# Altium schematic sheet DAC.SchDoc
size A4
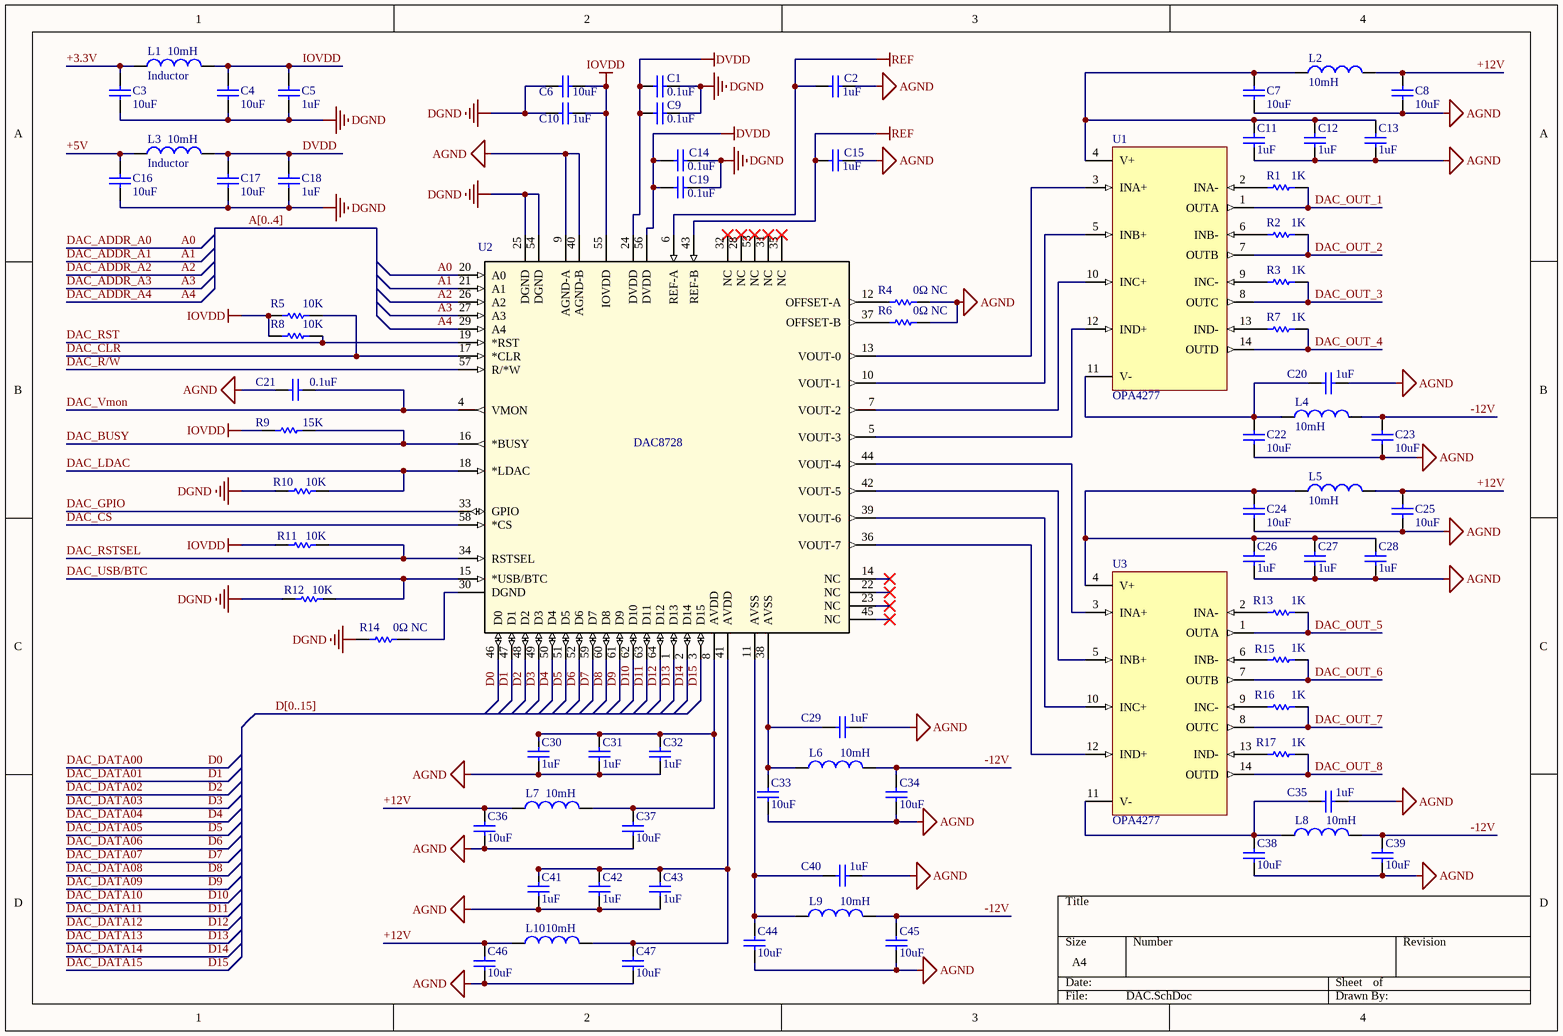
[diagram p0: DAC.SchDoc]

## Parts
C1  value 0.1uF  [1608[0603]]  (hidden comment: Cap)
C2  value 1uF  [1608[0603]]  (hidden comment: Cap)
C3  value 10uF  [1608[0603]]  (hidden comment: Cap)
C4  value 10uF  [1608[0603]]  (hidden comment: Cap)
C5  value 1uF  [1608[0603]]  (hidden comment: Cap)
C6  value 10uF  [1608[0603]]  (hidden comment: Cap)
C7  value 10uF  [1608[0603]]  (hidden comment: Cap)
C8  value 10uF  [1608[0603]]  (hidden comment: Cap)
C9  value 0.1uF  [1608[0603]]  (hidden comment: Cap)
C10  value 1uF  [1608[0603]]  (hidden comment: Cap)
C11  value 1uF  [1608[0603]]  (hidden comment: Cap)
C12  value 1uF  [1608[0603]]  (hidden comment: Cap)
C13  value 1uF  [1608[0603]]  (hidden comment: Cap)
C14  value 0.1uF  [1608[0603]]  (hidden comment: Cap)
C15  value 1uF  [1608[0603]]  (hidden comment: Cap)
C16  value 10uF  [1608[0603]]  (hidden comment: Cap)
C17  value 10uF  [1608[0603]]  (hidden comment: Cap)
C18  value 1uF  [1608[0603]]  (hidden comment: Cap)
C19  value 0.1uF  [1608[0603]]  (hidden comment: Cap)
C20  value 1uF  [1608[0603]]  (hidden comment: Cap)
C21  value 0.1uF  [1608[0603]]  (hidden comment: Cap)
C22  value 10uF  [1608[0603]]  (hidden comment: Cap)
C23  value 10uF  [1608[0603]]  (hidden comment: Cap)
C24  value 10uF  [1608[0603]]  (hidden comment: Cap)
C25  value 10uF  [1608[0603]]  (hidden comment: Cap)
C26  value 1uF  [1608[0603]]  (hidden comment: Cap)
C27  value 1uF  [1608[0603]]  (hidden comment: Cap)
C28  value 1uF  [1608[0603]]  (hidden comment: Cap)
C29  value 1uF  [1608[0603]]  (hidden comment: Cap)
C30  value 1uF  [1608[0603]]  (hidden comment: Cap)
C31  value 1uF  [1608[0603]]  (hidden comment: Cap)
C32  value 1uF  [1608[0603]]  (hidden comment: Cap)
C33  value 10uF  [1608[0603]]  (hidden comment: Cap)
C34  value 10uF  [1608[0603]]  (hidden comment: Cap)
C35  value 1uF  [1608[0603]]  (hidden comment: Cap)
C36  value 10uF  [1608[0603]]  (hidden comment: Cap)
C37  value 10uF  [1608[0603]]  (hidden comment: Cap)
C38  value 10uF  [1608[0603]]  (hidden comment: Cap)
C39  value 10uF  [1608[0603]]  (hidden comment: Cap)
C40  value 1uF  [1608[0603]]  (hidden comment: Cap)
C41  value 1uF  [1608[0603]]  (hidden comment: Cap)
C42  value 1uF  [1608[0603]]  (hidden comment: Cap)
C43  value 1uF  [1608[0603]]  (hidden comment: Cap)
C44  value 10uF  [1608[0603]]  (hidden comment: Cap)
C45  value 10uF  [1608[0603]]  (hidden comment: Cap)
C46  value 10uF  [1608[0603]]  (hidden comment: Cap)
C47  value 10uF  [1608[0603]]  (hidden comment: Cap)
L1  Inductor  value 10mH  [2029]
L2  value 10mH  [2029]  (hidden comment: Inductor)
L3  Inductor  value 10mH  [2029]
L4  value 10mH  [2029]  (hidden comment: Inductor)
L5  value 10mH  [2029]  (hidden comment: Inductor)
L6  value 10mH  [2029]  (hidden comment: Inductor)
L7  value 10mH  [2029]  (hidden comment: Inductor)
L8  value 10mH  [2029]  (hidden comment: Inductor)
L9  value 10mH  [2029]  (hidden comment: Inductor)
L10  value 10mH  [2029]  (hidden comment: Inductor)
R1  value 1K  [1608[0603]]  (hidden comment: Res1)
R2  value 1K  [1608[0603]]  (hidden comment: Res1)
R3  value 1K  [1608[0603]]  (hidden comment: Res1)
R4  value 0Ω NC  [1608[0603]]  (hidden comment: Res1)
R5  value 10K  [1608[0603]]  (hidden comment: Res1)
R6  value 0Ω NC  [1608[0603]]  (hidden comment: Res1)
R7  value 1K  [1608[0603]]  (hidden comment: Res1)
R8  value 10K  [1608[0603]]  (hidden comment: Res1)
R9  value 15K  [1608[0603]]  (hidden comment: Res1)
R10  value 10K  [1608[0603]]  (hidden comment: Res1)
R11  value 10K  [1608[0603]]  (hidden comment: Res1)
R12  value 10K  [1608[0603]]  (hidden comment: Res1)
R13  value 1K  [1608[0603]]  (hidden comment: Res1)
R14  value 0Ω NC  [1608[0603]]  (hidden comment: Res1)
R15  value 1K  [1608[0603]]  (hidden comment: Res1)
R16  value 1K  [1608[0603]]  (hidden comment: Res1)
R17  value 1K  [1608[0603]]  (hidden comment: Res1)
U1  OPA4277  [OPA4277_SOIC]
U2  DAC8728  [DAC8728]
U3  OPA4277  [OPA4277_SOIC]

## Nets
AGND: C2.1 C7.2 C8.2 C11.2 C12.2 C13.2 C15.1 C20.2 C21.2 C22.2 C23.2 C24.2 C25.2 C26.2 C27.2 C28.2 C29.2 C30.2 C31.2 C32.2 C33.2 C34.2 C35.2 C36.2 C37.2 C38.2 C39.2 C40.2 C41.2 C42.2 C43.2 C44.2 C45.2 C46.2 C47.2 R4.2 R6.2 U2.9(AGND-A) U2.40(AGND-B)
DGND: C1.2 C3.1 C4.1 C5.1 C6.1 C9.1 C10.2 C14.2 C16.1 C17.1 C18.1 C19.1 R10.2 R12.2 R14.1 U2.25(DGND) U2.54(DGND)
DVDD: C1.1 C9.2 C14.1 C17.2 C18.2 C19.2 L3.2 U2.24(DVDD) U2.56(DVDD)
IOVDD: C4.2 C5.2 C6.2 C10.1 L1.2 R5.1 R8.1 R9.2 R11.2 U2.55(IOVDD)
REF: C2.2 C15.2 U2.6(REF-A) U2.43(REF-B)
+3.3V: C3.2 L1.1
+5V: C16.2 L3.1
+12V: C8.1 C25.1 C36.1 C46.1 L2.1 L5.1 L7.1 L10.1
-12V: C23.1 C34.1 C39.1 C45.1 L4.2 L6.2 L8.2 L9.2
A0: U2.20(A0)  [also labelled DAC_ADDR_A0]
A1: U2.21(A1)  [also labelled DAC_ADDR_A1]
A2: U2.26(A2)  [also labelled DAC_ADDR_A2]
A3: U2.27(A3)  [also labelled DAC_ADDR_A3]
A4: U2.29(A4)  [also labelled DAC_ADDR_A4]
D0: U2.46(D0)  [also labelled DAC_DATA00]
D1: U2.47(D1)  [also labelled DAC_DATA01]
D2: U2.48(D2)  [also labelled DAC_DATA02]
D3: U2.49(D3)  [also labelled DAC_DATA03]
D4: U2.50(D4)  [also labelled DAC_DATA04]
D5: U2.51(D5)  [also labelled DAC_DATA05]
D6: U2.52(D6)  [also labelled DAC_DATA06]
D7: U2.59(D7)  [also labelled DAC_DATA07]
D8: U2.60(D8)  [also labelled DAC_DATA08]
D9: U2.61(D9)  [also labelled DAC_DATA09]
D10: U2.62(D10)  [also labelled DAC_DATA10]
D11: U2.63(D11)  [also labelled DAC_DATA11]
D12: U2.64(D12)  [also labelled DAC_DATA12]
D13: U2.1(D13)  [also labelled DAC_DATA13]
D14: U2.2(D14)  [also labelled DAC_DATA14]
D15: U2.3(D15)  [also labelled DAC_DATA15]
DAC_BUSY: R9.1 U2.16(*BUSY)
DAC_CLR: R5.2 U2.17(*CLR)
DAC_CS: U2.58(*CS)
DAC_GPIO: U2.33(GPIO)
DAC_LDAC: R10.1 U2.18(*LDAC)
DAC_OUT_1: R1.2 U1.1(OUTA)
DAC_OUT_2: R2.2 U1.7(OUTB)
DAC_OUT_3: R3.2 U1.8(OUTC)
DAC_OUT_4: R7.2 U1.14(OUTD)
DAC_OUT_5: R13.2 U3.1(OUTA)
DAC_OUT_6: R15.2 U3.7(OUTB)
DAC_OUT_7: R16.2 U3.8(OUTC)
DAC_OUT_8: R17.2 U3.14(OUTD)
DAC_R/W: U2.57(R/*W)
DAC_RST: R8.2 U2.19(*RST)
DAC_RSTSEL: R11.1 U2.34(RSTSEL)
DAC_USB/BTC: R12.1 U2.15(*USB/BTC)
DAC_Vmon: C21.1 U2.4(VMON)
NetC7_1: C7.1 C11.1 C12.1 C13.1 L2.2 U1.4(V+)
NetC20_1: C20.1 C22.1 L4.1 U1.11(V-)
NetC24_1: C24.1 C26.1 C27.1 C28.1 L5.2 U3.4(V+)
NetC29_1: C29.1 C33.1 L6.1 U2.38(AVSS)
NetC30_1: C30.1 C31.1 C32.1 C37.1 L7.2 U2.8(AVDD)
NetC35_1: C35.1 C38.1 L8.1 U3.11(V-)
NetC40_1: C40.1 C44.1 L9.1 U2.11(AVSS)
NetC41_1: C41.1 C42.1 C43.1 C47.1 L10.2 U2.41(AVDD)
NetR1_1: R1.1 U1.2(INA-)
NetR2_1: R2.1 U1.6(INB-)
NetR3_1: R3.1 U1.9(INC-)
NetR4_1: R4.1 U2.12(OFFSET-A)
NetR6_1: R6.1 U2.37(OFFSET-B)
NetR7_1: R7.1 U1.13(IND-)
NetR13_1: R13.1 U3.2(INA-)
NetR14_2: R14.2 U2.30(DGND)
NetR15_1: R15.1 U3.6(INB-)
NetR16_1: R16.1 U3.9(INC-)
NetR17_1: R17.1 U3.13(IND-)
NetU1_3: U1.3(INA+) U2.13(VOUT-0)
NetU1_5: U1.5(INB+) U2.10(VOUT-1)
NetU1_10: U1.10(INC+) U2.7(VOUT-2)
NetU1_12: U1.12(IND+) U2.5(VOUT-3)
NetU2_36: U2.36(VOUT-7) U3.12(IND+)
NetU2_39: U2.39(VOUT-6) U3.10(INC+)
NetU2_42: U2.42(VOUT-5) U3.5(INB+)
NetU2_44: U2.44(VOUT-4) U3.3(INA+)

Not connected (* = marked no-connect by the designer): U2 14(NC)* 22(NC)* 23(NC)* 28(NC)* 31(NC)* 32(NC)* 35(NC)* 45(NC)* 53(NC)*

## Buses and harness runs
bus A[0..4]
bus D[0..15]

## Library data of the parts
C1-C47 = Cap: Capacitor; Published: 8-Jun-2000; LatestRevisionDate: 17-Jul-2002; LatestRevisionNote: Re-released for DXP Platform.; PackageReference: RAD-0.3; Publisher: Altium Limited; PackageDescription: Radial Cap, Thru-Hole; 2 Leads; 0.3 in Pin Spacing
L1-L10 = Inductor: Code_IEC: 1005; Published: 8-Jun-2000; LatestRevisionDate: 29-May-2009; LatestRevisionNote: IPC-7351 Footprint Added.; PackageReference: 0402-A; Publisher: Altium Limited; PackageDescription: Chip Inductor; Code_JEITA: 0402
R1-R17 = Res1: Resistor; Published: 8-Jun-2000; LatestRevisionDate: 17-Jul-2002; LatestRevisionNote: Re-released for DXP Platform.; PackageReference: AXIAL-0.3; Publisher: Altium Limited; PackageDescription: Axial Device, Thru-Hole; 2 Leads; 0.3 in Pin Spacing